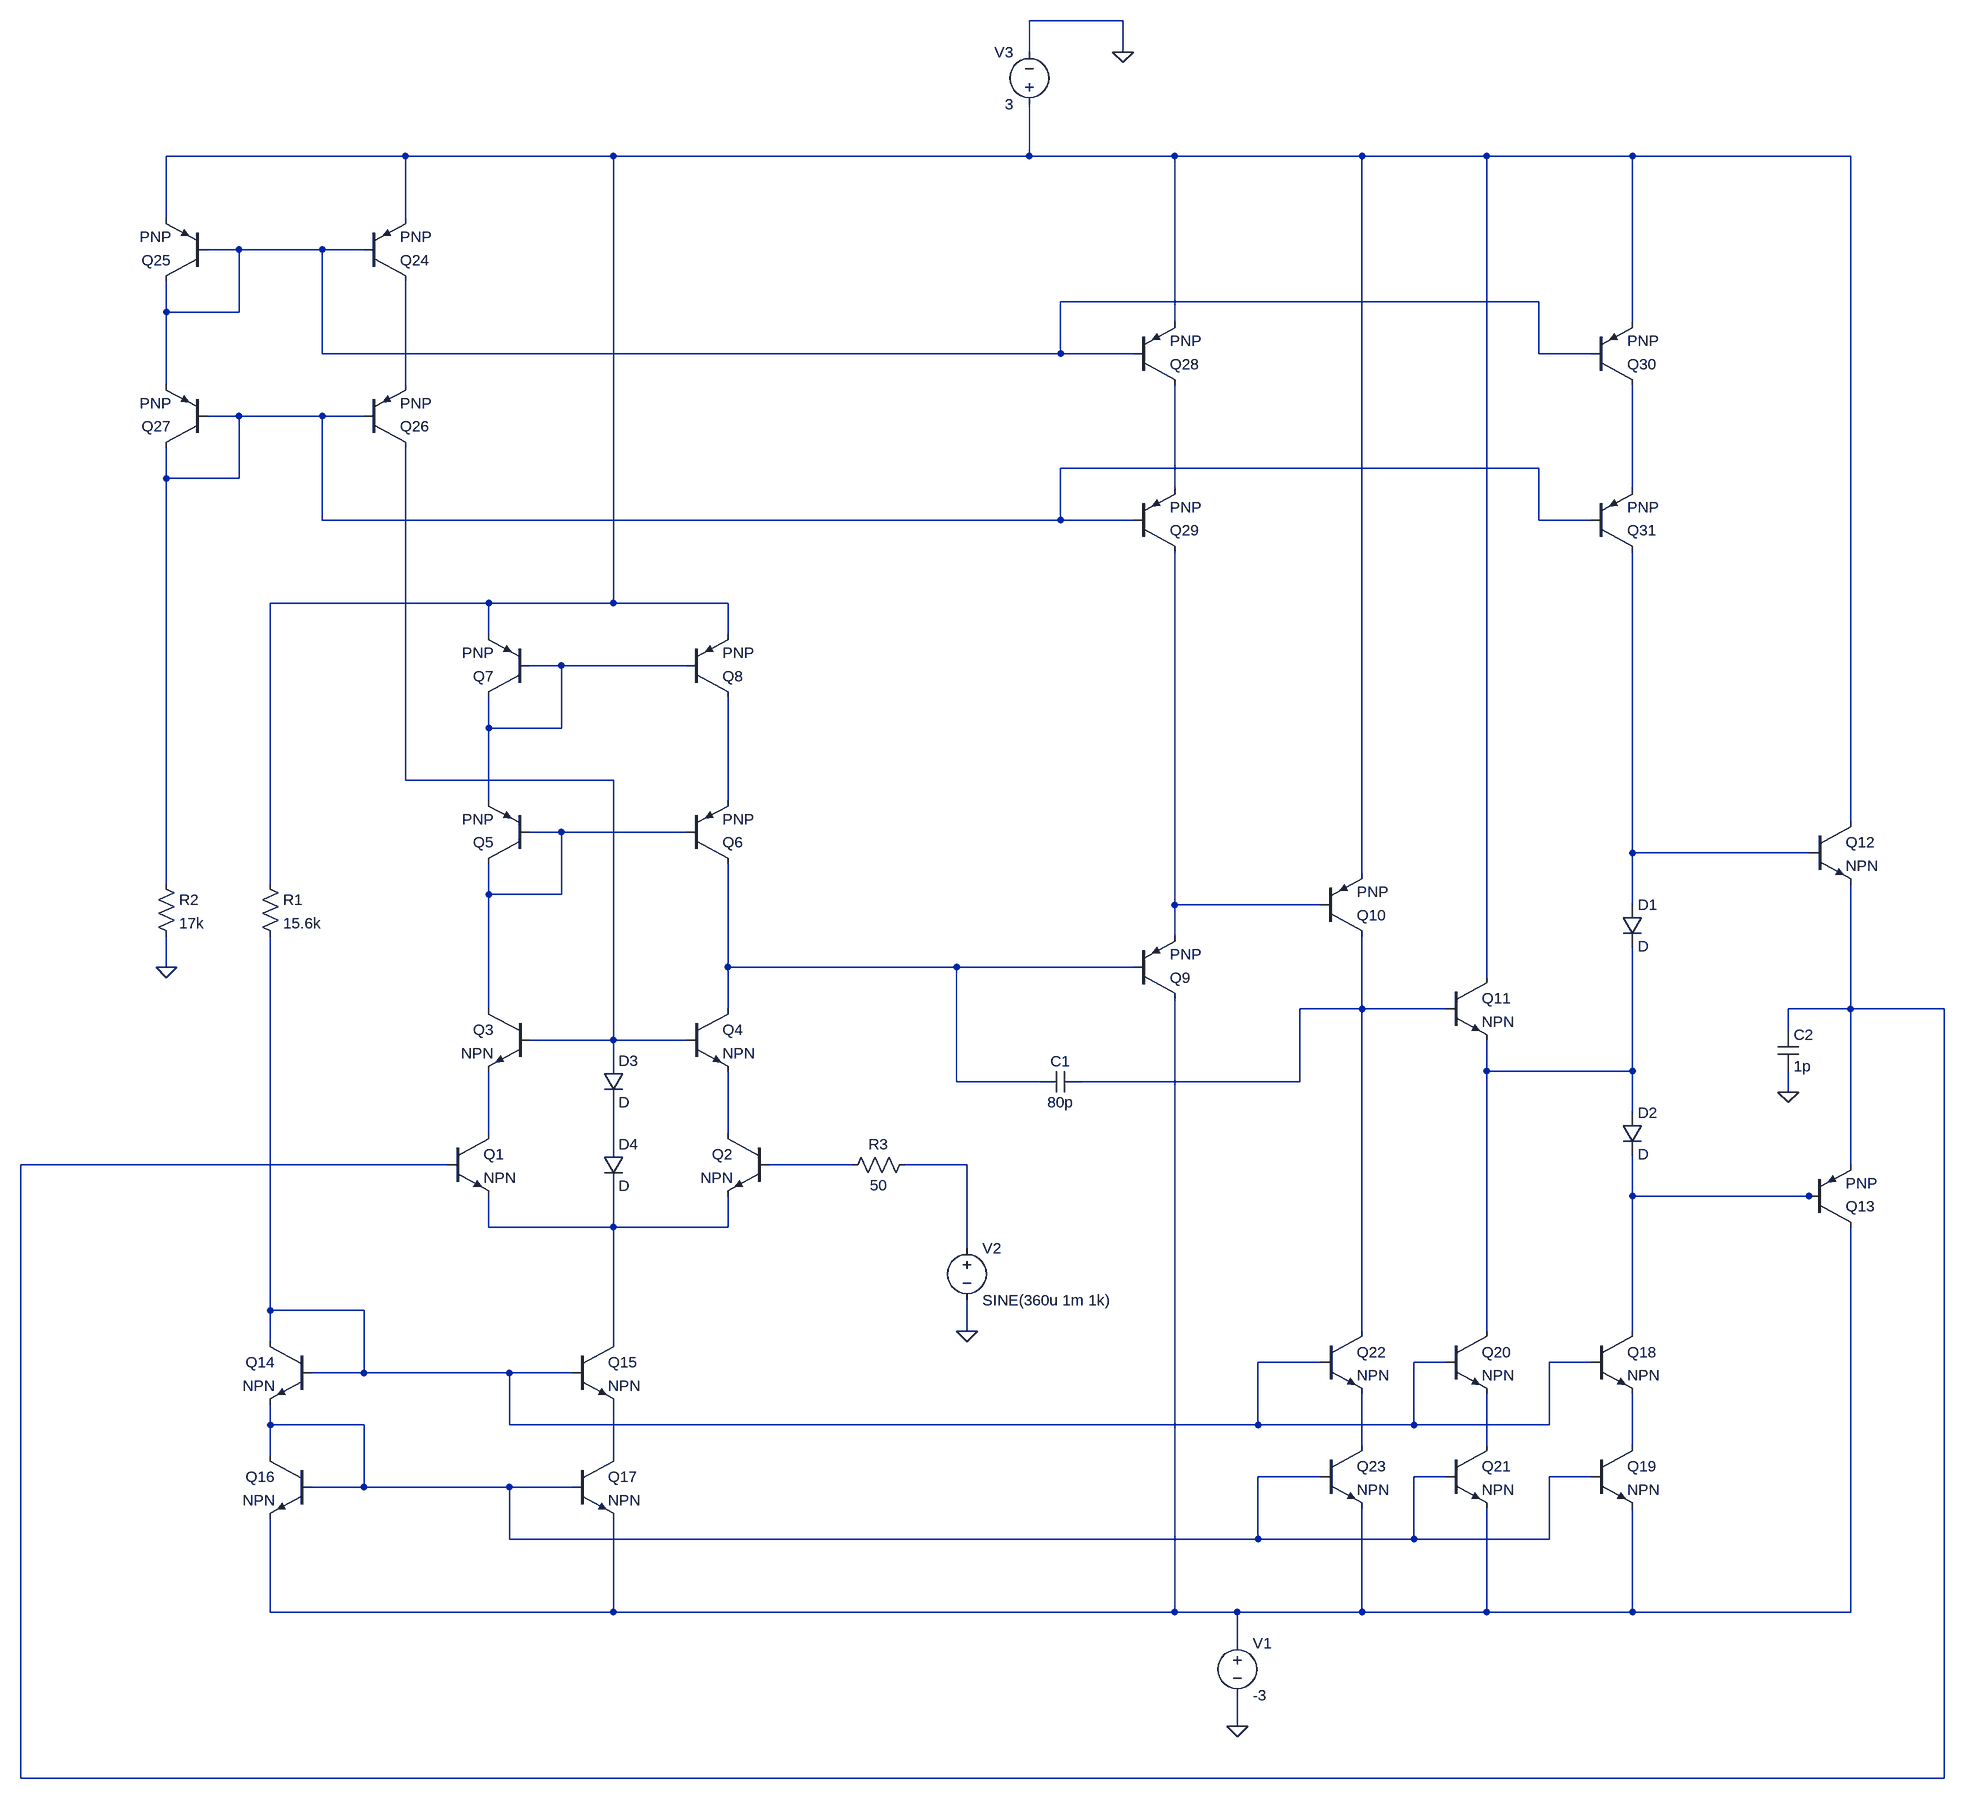
[diagram p0: schematic project.asc]
project.asc, the LTspice schematic file:
Version 4
SHEET 1 2292 1188
WIRE 1024 -1520 880 -1520
WIRE 880 -1472 880 -1520
WIRE 1024 -1472 1024 -1520
WIRE -80 -1312 -448 -1312
WIRE 240 -1312 -80 -1312
WIRE 880 -1312 880 -1392
WIRE 880 -1312 240 -1312
WIRE 1104 -1312 880 -1312
WIRE 1392 -1312 1104 -1312
WIRE 1584 -1312 1392 -1312
WIRE 1808 -1312 1584 -1312
WIRE 2144 -1312 1808 -1312
WIRE -448 -1216 -448 -1312
WIRE -80 -1216 -80 -1312
WIRE -336 -1168 -384 -1168
WIRE -208 -1168 -336 -1168
WIRE -144 -1168 -208 -1168
WIRE 1664 -1088 928 -1088
WIRE -448 -1072 -448 -1120
WIRE -336 -1072 -336 -1168
WIRE -336 -1072 -448 -1072
WIRE 1104 -1056 1104 -1312
WIRE 1808 -1056 1808 -1312
WIRE -208 -1008 -208 -1168
WIRE 928 -1008 928 -1088
WIRE 928 -1008 -208 -1008
WIRE 1040 -1008 928 -1008
WIRE 1664 -1008 1664 -1088
WIRE 1744 -1008 1664 -1008
WIRE -448 -960 -448 -1072
WIRE -80 -960 -80 -1120
WIRE -336 -912 -384 -912
WIRE -208 -912 -336 -912
WIRE -144 -912 -208 -912
WIRE 1664 -832 928 -832
WIRE -448 -816 -448 -864
WIRE -336 -816 -336 -912
WIRE -336 -816 -448 -816
WIRE 1104 -800 1104 -960
WIRE 1808 -800 1808 -960
WIRE -208 -752 -208 -912
WIRE 928 -752 928 -832
WIRE 928 -752 -208 -752
WIRE 1040 -752 928 -752
WIRE 1664 -752 1664 -832
WIRE 1744 -752 1664 -752
WIRE 48 -624 -288 -624
WIRE 240 -624 240 -1312
WIRE 240 -624 48 -624
WIRE 416 -624 240 -624
WIRE 48 -576 48 -624
WIRE 416 -576 416 -624
WIRE 160 -528 112 -528
WIRE 352 -528 160 -528
WIRE 48 -432 48 -480
WIRE 160 -432 160 -528
WIRE 160 -432 48 -432
WIRE -80 -352 -80 -864
WIRE 240 -352 -80 -352
WIRE 48 -320 48 -432
WIRE 416 -320 416 -480
WIRE 2144 -288 2144 -1312
WIRE 160 -272 112 -272
WIRE 352 -272 160 -272
WIRE 1808 -240 1808 -704
WIRE 2080 -240 1808 -240
WIRE 1392 -208 1392 -1312
WIRE -448 -192 -448 -816
WIRE -288 -192 -288 -624
WIRE 48 -176 48 -224
WIRE 160 -176 160 -272
WIRE 160 -176 48 -176
WIRE 1104 -160 1104 -704
WIRE 1328 -160 1104 -160
WIRE 1808 -160 1808 -240
WIRE 1104 -112 1104 -160
WIRE -448 -64 -448 -112
WIRE 416 -64 416 -224
WIRE 768 -64 416 -64
WIRE 1040 -64 768 -64
WIRE 1584 -48 1584 -1312
WIRE 48 0 48 -176
WIRE 416 0 416 -64
WIRE 1392 0 1392 -112
WIRE 1392 0 1296 0
WIRE 1520 0 1392 0
WIRE 2144 0 2144 -192
WIRE 2144 0 2048 0
WIRE 2288 0 2144 0
WIRE 2048 32 2048 0
WIRE 240 48 240 -352
WIRE 240 48 112 48
WIRE 352 48 240 48
WIRE 240 80 240 48
WIRE 1584 96 1584 48
WIRE 1808 96 1808 -96
WIRE 1808 96 1584 96
WIRE 768 112 768 -64
WIRE 896 112 768 112
WIRE 1296 112 1296 0
WIRE 1296 112 960 112
WIRE 2048 128 2048 96
WIRE 1808 160 1808 96
WIRE 48 192 48 96
WIRE 416 192 416 96
WIRE 240 208 240 144
WIRE -16 240 -672 240
WIRE 608 240 480 240
WIRE 784 240 688 240
WIRE 2144 240 2144 0
WIRE 1808 288 1808 224
WIRE 2080 288 1808 288
WIRE 2096 288 2080 288
WIRE 48 336 48 288
WIRE 240 336 240 272
WIRE 240 336 48 336
WIRE 416 336 416 288
WIRE 416 336 240 336
WIRE 784 368 784 240
WIRE -288 464 -288 -112
WIRE -144 464 -288 464
WIRE 784 496 784 448
WIRE 1392 496 1392 0
WIRE 1584 496 1584 96
WIRE 1808 496 1808 288
WIRE -288 512 -288 464
WIRE 240 512 240 336
WIRE 1328 544 1232 544
WIRE 1520 544 1472 544
WIRE 1744 544 1680 544
WIRE -144 560 -144 464
WIRE -144 560 -224 560
WIRE 80 560 -144 560
WIRE 176 560 80 560
WIRE -288 640 -288 608
WIRE -144 640 -288 640
WIRE 80 640 80 560
WIRE 1232 640 1232 544
WIRE 1232 640 80 640
WIRE 1472 640 1472 544
WIRE 1472 640 1232 640
WIRE 1680 640 1680 544
WIRE 1680 640 1472 640
WIRE 1392 672 1392 592
WIRE 1584 672 1584 592
WIRE 1808 672 1808 592
WIRE -288 688 -288 640
WIRE 240 688 240 608
WIRE 1328 720 1232 720
WIRE 1520 720 1472 720
WIRE 1744 720 1680 720
WIRE -144 736 -144 640
WIRE -144 736 -224 736
WIRE 80 736 -144 736
WIRE 176 736 80 736
WIRE 80 816 80 736
WIRE 1232 816 1232 720
WIRE 1232 816 80 816
WIRE 1472 816 1472 720
WIRE 1472 816 1232 816
WIRE 1680 816 1680 720
WIRE 1680 816 1472 816
WIRE -288 928 -288 784
WIRE 240 928 240 784
WIRE 240 928 -288 928
WIRE 1104 928 1104 -16
WIRE 1104 928 240 928
WIRE 1200 928 1104 928
WIRE 1392 928 1392 768
WIRE 1392 928 1200 928
WIRE 1584 928 1584 768
WIRE 1584 928 1392 928
WIRE 1808 928 1808 768
WIRE 1808 928 1584 928
WIRE 2144 928 2144 336
WIRE 2144 928 1808 928
WIRE 1200 976 1200 928
WIRE 1200 1104 1200 1056
WIRE -672 1184 -672 240
WIRE 2288 1184 2288 0
WIRE 2288 1184 -672 1184
FLAG 2048 128 0
FLAG 1200 1104 0
FLAG 784 496 0
FLAG 1024 -1472 0
FLAG -448 -64 0
SYMBOL npn -16 192 R0
SYMATTR InstName Q1
SYMBOL npn 480 192 M0
SYMATTR InstName Q2
SYMBOL pnp 352 -480 M180
SYMATTR InstName Q8
SYMBOL pnp 112 -480 R180
SYMATTR InstName Q7
SYMBOL pnp 1040 -16 M180
SYMATTR InstName Q9
SYMBOL pnp 1328 -112 M180
SYMATTR InstName Q10
SYMBOL npn 1520 -48 R0
SYMATTR InstName Q11
SYMBOL diode 1792 -160 R0
SYMATTR InstName D1
SYMBOL diode 1792 160 R0
SYMATTR InstName D2
SYMBOL npn 2080 -288 R0
SYMATTR InstName Q12
SYMBOL cap 2032 32 R0
SYMATTR InstName C2
SYMATTR Value 1p
SYMBOL pnp 2080 336 M180
SYMATTR InstName Q13
SYMBOL pnp 352 -224 M180
SYMATTR InstName Q6
SYMBOL pnp 112 -224 R180
SYMATTR InstName Q5
SYMBOL npn 112 0 M0
SYMATTR InstName Q3
SYMBOL npn 352 0 R0
SYMATTR InstName Q4
SYMBOL diode 224 80 R0
SYMATTR InstName D3
SYMBOL diode 224 208 R0
SYMATTR InstName D4
SYMBOL npn -224 512 M0
SYMATTR InstName Q14
SYMBOL npn 176 512 R0
SYMATTR InstName Q15
SYMBOL npn -224 688 M0
SYMATTR InstName Q16
SYMBOL voltage 1200 960 R0
WINDOW 123 0 0 Left 0
WINDOW 39 0 0 Left 0
SYMATTR InstName V1
SYMATTR Value -3
SYMBOL cap 960 96 R90
WINDOW 0 0 32 VBottom 2
WINDOW 3 32 32 VTop 2
SYMATTR InstName C1
SYMATTR Value 80p
SYMBOL npn 176 688 R0
SYMATTR InstName Q17
SYMBOL res -304 -208 R0
SYMATTR InstName R1
SYMATTR Value 15.6k
SYMBOL npn 1744 496 R0
SYMATTR InstName Q18
SYMBOL npn 1744 672 R0
SYMATTR InstName Q19
SYMBOL npn 1520 496 R0
SYMATTR InstName Q20
SYMBOL npn 1520 672 R0
SYMATTR InstName Q21
SYMBOL npn 1328 496 R0
SYMATTR InstName Q22
SYMBOL npn 1328 672 R0
SYMATTR InstName Q23
SYMBOL voltage 784 352 R0
WINDOW 123 0 0 Left 0
WINDOW 39 0 0 Left 0
SYMATTR InstName V2
SYMATTR Value SINE(360u 1m 1k)
SYMBOL pnp -144 -1120 M180
SYMATTR InstName Q24
SYMBOL pnp -384 -1120 R180
SYMATTR InstName Q25
SYMBOL pnp -144 -864 M180
SYMATTR InstName Q26
SYMBOL pnp -384 -864 R180
SYMATTR InstName Q27
SYMBOL pnp 1744 -960 M180
SYMATTR InstName Q30
SYMBOL pnp 1744 -704 M180
SYMATTR InstName Q31
SYMBOL voltage 880 -1376 R180
WINDOW 0 24 96 Left 2
WINDOW 3 24 16 Left 2
WINDOW 123 0 0 Left 0
WINDOW 39 0 0 Left 0
SYMATTR InstName V3
SYMATTR Value 3
SYMBOL res -464 -208 R0
SYMATTR InstName R2
SYMATTR Value 17k
SYMBOL pnp 1040 -960 M180
SYMATTR InstName Q28
SYMBOL pnp 1040 -704 M180
SYMATTR InstName Q29
SYMBOL res 704 224 R90
WINDOW 0 0 56 VBottom 2
WINDOW 3 32 56 VTop 2
SYMATTR InstName R3
SYMATTR Value 50

The netlist it stands for:
* project.asc
Q1 N017 N015 N023 0 NPN
Q2 N018 N020 N023 0 NPN
Q8 N009 N007 N001 0 PNP
Q7 N007 N007 N001 0 PNP
Q9 N030 N013 N012 0 PNP
Q10 N014 N012 N001 0 PNP
Q11 N001 N014 N016 0 NPN
D1 N011 N016 D
D2 N016 N022 D
Q12 N001 N011 N015 0 NPN
C2 N015 0 1p
Q13 N030 N022 N015 0 PNP
Q6 N013 N010 N009 0 PNP
Q5 N010 N010 N007 0 PNP
Q3 N010 N008 N017 0 NPN
Q4 N013 N008 N018 0 NPN
D3 N008 N019 D
D4 N019 N023 D
Q14 N024 N024 N025 0 NPN
Q15 N023 N024 N029 0 NPN
Q16 N025 N025 N030 0 NPN
V1 N030 0 -3
C1 N014 N013 80p
Q17 N029 N025 N030 0 NPN
R1 N001 N024 15.6k
Q18 N022 N024 N028 0 NPN
Q19 N028 N025 N030 0 NPN
Q20 N016 N024 N027 0 NPN
Q21 N027 N025 N030 0 NPN
Q22 N014 N024 N026 0 NPN
Q23 N026 N025 N030 0 NPN
V2 N021 0 SINE(360u 1m 1k)
Q24 N003 N002 N001 0 PNP
Q25 N002 N002 N001 0 PNP
Q26 N008 N004 N003 0 PNP
Q27 N004 N004 N002 0 PNP
Q30 N006 N002 N001 0 PNP
Q31 N011 N004 N006 0 PNP
V3 N001 0 3
R2 N004 0 17k
Q28 N005 N002 N001 0 PNP
Q29 N012 N004 N005 0 PNP
R3 N021 N020 50
.model D D
.lib standard.dio
.model NPN NPN
.model PNP PNP
.lib standard.bjt
.backanno
.end